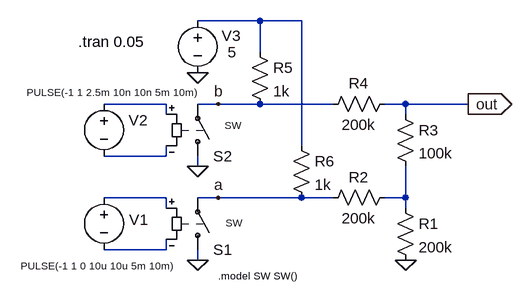
[diagram p0: schematic rotary-encoder-right.asc]
rotary-encoder-right.asc, the LTspice schematic file:
Version 4
SHEET 1 880 680
WIRE 128 -64 32 -64
WIRE 192 -64 128 -64
WIRE 128 -16 128 -64
WIRE -16 64 -112 64
WIRE 64 64 32 64
WIRE 128 64 64 64
WIRE 240 64 128 64
WIRE 352 64 320 64
WIRE 448 64 352 64
WIRE -16 80 -16 64
WIRE 352 80 352 64
WIRE 192 128 192 -64
WIRE -16 144 -16 128
WIRE -16 144 -112 144
WIRE 32 160 32 144
WIRE -16 208 -112 208
WIRE 64 208 32 208
WIRE 192 208 64 208
WIRE 240 208 192 208
WIRE 352 208 352 160
WIRE 352 208 320 208
WIRE -16 224 -16 208
WIRE 352 224 352 208
WIRE -16 288 -16 272
WIRE -16 288 -112 288
WIRE 32 304 32 288
FLAG 352 304 0
FLAG 448 64 out
IOPIN 448 64 Out
FLAG 32 16 0
FLAG 32 160 0
FLAG 32 304 0
FLAG 64 208 a
FLAG 64 64 b
SYMBOL res 336 208 R0
SYMATTR InstName R1
SYMATTR Value 200k
SYMATTR SpiceLine tol=5
SYMBOL res 336 192 R90
WINDOW 0 0 56 VBottom 2
WINDOW 3 32 56 VTop 2
SYMATTR InstName R2
SYMATTR Value 200k
SYMATTR SpiceLine tol=5
SYMBOL res 336 64 R0
SYMATTR InstName R3
SYMATTR Value 100k
SYMATTR SpiceLine tol=5
SYMBOL res 336 48 R90
WINDOW 0 0 56 VBottom 2
WINDOW 3 32 56 VTop 2
SYMATTR InstName R4
SYMATTR Value 200k
SYMATTR SpiceLine tol=5
SYMBOL sw 32 304 M180
WINDOW 3 43 57 Left 1
SYMATTR InstName S1
SYMBOL sw 32 160 M180
WINDOW 3 42 63 Left 1
SYMATTR InstName S2
SYMBOL voltage -112 192 R0
WINDOW 0 39 50 Left 2
WINDOW 3 -128 121 Left 1
WINDOW 123 0 0 Left 0
WINDOW 39 0 0 Left 0
SYMATTR InstName V1
SYMATTR Value PULSE(-1 1 0 10u 10u 5m 10m)
SYMBOL voltage -112 48 R0
WINDOW 0 38 41 Left 2
WINDOW 3 -119 -2 Left 1
WINDOW 123 0 0 Left 0
WINDOW 39 0 0 Left 0
SYMATTR InstName V2
SYMATTR Value PULSE(-1 1 2.5m 10n 10n 5m 10m)
SYMBOL voltage 32 -80 R0
WINDOW 0 37 39 Left 2
WINDOW 3 46 64 Left 2
WINDOW 123 0 0 Left 0
WINDOW 39 0 0 Left 0
SYMATTR InstName V3
SYMATTR Value 5
SYMBOL res 112 -32 R0
SYMATTR InstName R5
SYMATTR Value 1k
SYMATTR SpiceLine tol=5
SYMBOL res 176 112 R0
SYMATTR InstName R6
SYMATTR Value 1k
SYMATTR SpiceLine tol=5
TEXT -152 -32 Left 2 !.tran 0.05
TEXT 64 328 Left 1 !.model SW SW()

The netlist it stands for:
* rotary-encoder-right.asc
R1 N005 0 200k tol=5
R2 N005 a 200k tol=5
R3 out N005 100k tol=5
R4 out b 200k tol=5
S1 0 a N004 N006 SW
S2 0 b N002 N003 SW
V1 N004 N006 PULSE(-1 1 0 10u 10u 5m 10m)
V2 N002 N003 PULSE(-1 1 2.5m 10n 10n 5m 10m)
V3 N001 0 5
R5 N001 b 1k tol=5
R6 N001 a 1k tol=5
.tran 0.05
.model SW SW()
.backanno
.end